# EAGLE design Protoboard MX4-7-9-ESP12 (EAGLE 7.7.0)
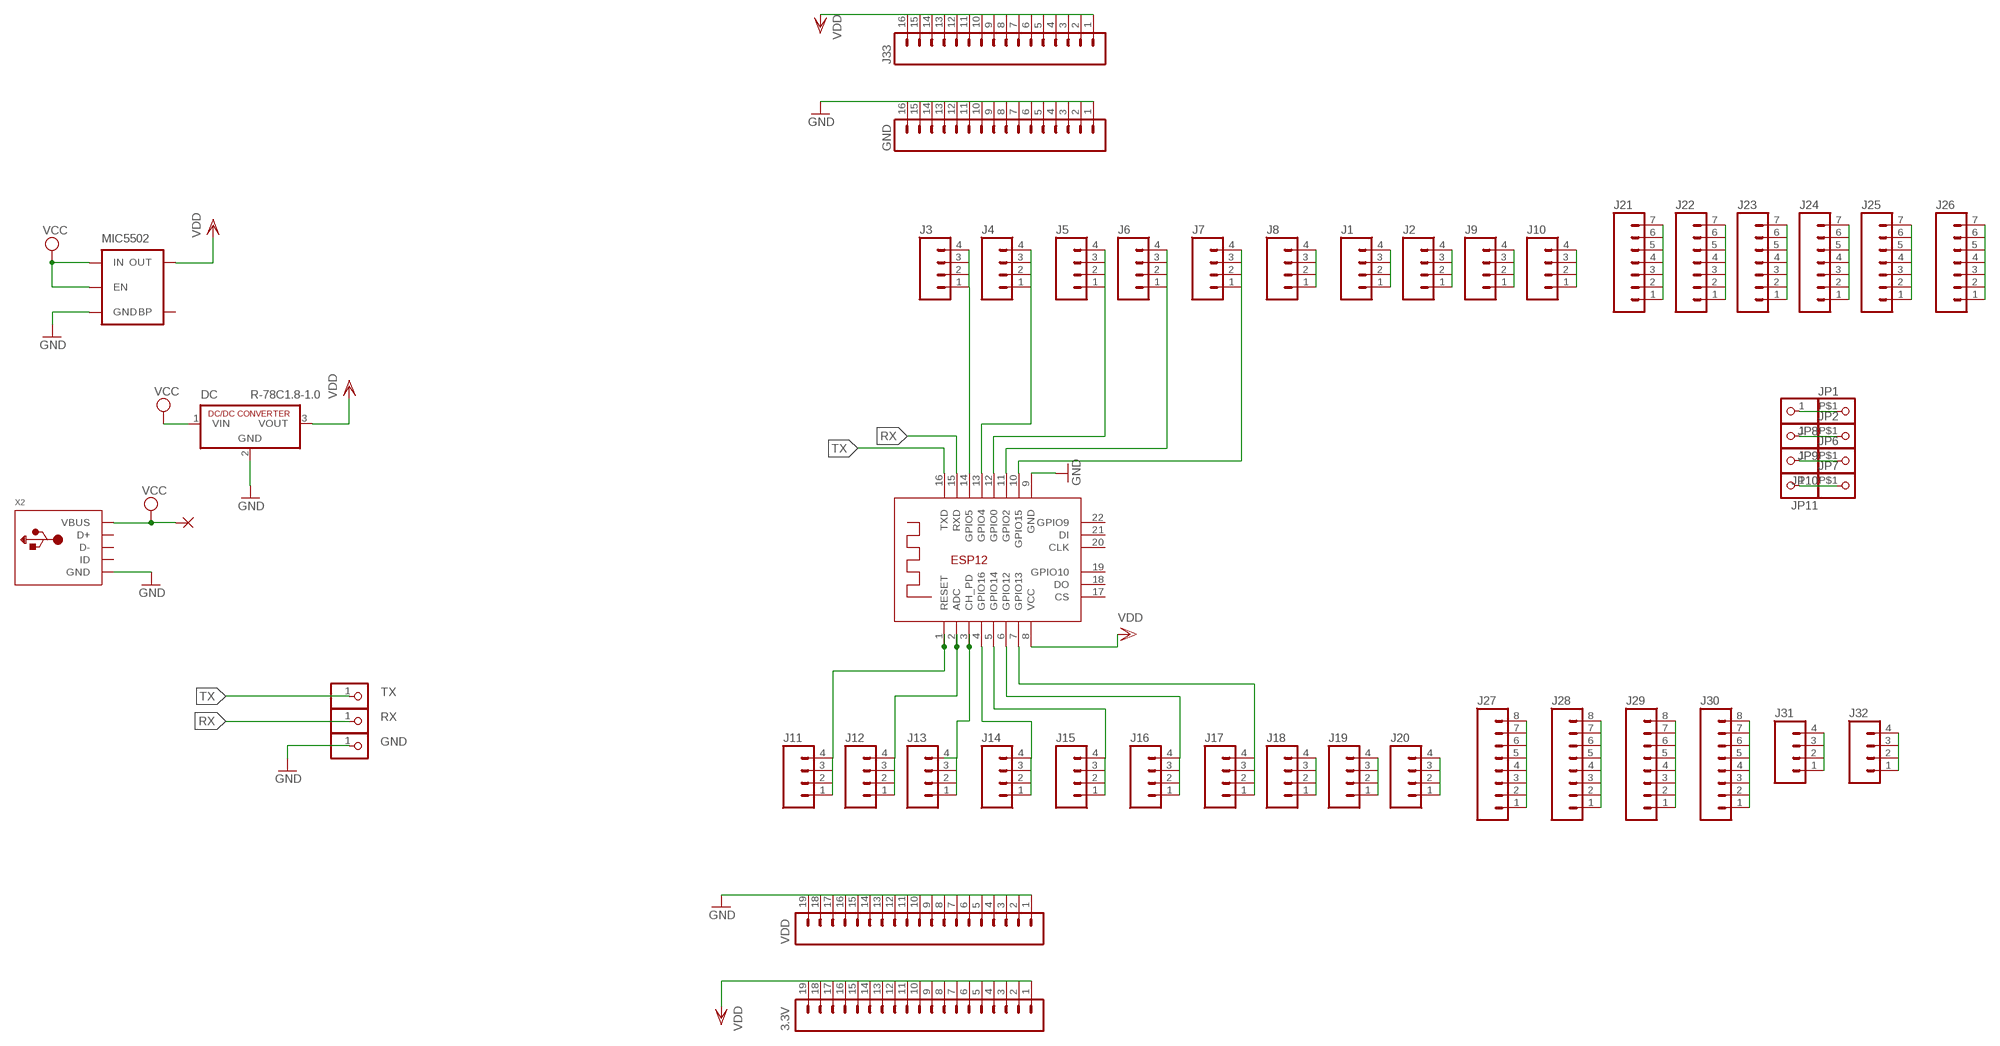
[diagram p0: schematic, sheet 1]

## Parts
3.3V  M191X19_NO_SILK  [1X19_NO_SILK]
5V  1,6/0,8  [1,6/0,8]
DC  R-78C1.8-1.0  [SIP3]
GND  M161X16_NO_SILK  [1X16_NO_SILK]
J1  M04NO_SILK_ALL_ROUND  [1X04_NO_SILK_ALL_ROUND]
J2  M04NO_SILK_ALL_ROUND  [1X04_NO_SILK_ALL_ROUND]
J3  M04NO_SILK_ALL_ROUND  [1X04_NO_SILK_ALL_ROUND]
J4  M04NO_SILK_ALL_ROUND  [1X04_NO_SILK_ALL_ROUND]
J5  M04NO_SILK_ALL_ROUND  [1X04_NO_SILK_ALL_ROUND]
J6  M04NO_SILK_ALL_ROUND  [1X04_NO_SILK_ALL_ROUND]
J7  M04NO_SILK_ALL_ROUND  [1X04_NO_SILK_ALL_ROUND]
J8  M04NO_SILK_ALL_ROUND  [1X04_NO_SILK_ALL_ROUND]
J9  M04NO_SILK_ALL_ROUND  [1X04_NO_SILK_ALL_ROUND]
J10  M04NO_SILK_ALL_ROUND  [1X04_NO_SILK_ALL_ROUND]
J11  M04NO_SILK_ALL_ROUND  [1X04_NO_SILK_ALL_ROUND]
J12  M04NO_SILK_ALL_ROUND  [1X04_NO_SILK_ALL_ROUND]
J13  M04NO_SILK_ALL_ROUND  [1X04_NO_SILK_ALL_ROUND]
J14  M04NO_SILK_ALL_ROUND  [1X04_NO_SILK_ALL_ROUND]
J15  M04NO_SILK_ALL_ROUND  [1X04_NO_SILK_ALL_ROUND]
J16  M04NO_SILK_ALL_ROUND  [1X04_NO_SILK_ALL_ROUND]
J17  M04NO_SILK_ALL_ROUND  [1X04_NO_SILK_ALL_ROUND]
J18  M04NO_SILK_ALL_ROUND  [1X04_NO_SILK_ALL_ROUND]
J19  M04NO_SILK_ALL_ROUND  [1X04_NO_SILK_ALL_ROUND]
J20  M04NO_SILK_ALL_ROUND  [1X04_NO_SILK_ALL_ROUND]
J21  M07NO_SILK  [1X07_NO_SILK]
J22  M07NO_SILK  [1X07_NO_SILK]
J23  M07NO_SILK  [1X07_NO_SILK]
J24  M07NO_SILK  [1X07_NO_SILK]
J25  M07NO_SILK  [1X07_NO_SILK]
J26  M07NO_SILK  [1X07_NO_SILK]
J27  M08NO_SILK_FEMALE_PTH  [1X08_NO_SILK]
J28  M08NO_SILK_FEMALE_PTH  [1X08_NO_SILK]
J29  M08NO_SILK_FEMALE_PTH  [1X08_NO_SILK]
J30  M08NO_SILK_FEMALE_PTH  [1X08_NO_SILK]
J31  M04NO_SILK_ALL_ROUND  [1X04_NO_SILK_ALL_ROUND]
J32  M04NO_SILK_ALL_ROUND  [1X04_NO_SILK_ALL_ROUND]
J33  M161X16_NO_SILK  [1X16_NO_SILK]
JP1  PINHD-1X1-BIGPOGO  [1X1-BIGPOGO]
JP2  PINHD-1X1-BIGPOGO  [1X1-BIGPOGO]
JP3  TX  PINHD-1X1CB  [1X01-CLEANBIG]
JP4  RX  PINHD-1X1CB  [1X01-CLEANBIG]
JP5  GND  PINHD-1X1CB  [1X01-CLEANBIG]
JP6  PINHD-1X1-BIGPOGO  [1X1-BIGPOGO]
JP7  PINHD-1X1-BIGPOGO  [1X1-BIGPOGO]
JP8  PINHD-1X1CB  [1X01-CLEANBIG]
JP9  PINHD-1X1CB  [1X01-CLEANBIG]
JP10  PINHD-1X1CB  [1X01-CLEANBIG]
JP11  PINHD-1X1CB  [1X01-CLEANBIG]
MIC5502  MIC52053.3V  [SOT23-5]
VDD  M191X19_NO_SILK  [1X19_NO_SILK]
X1  ESP-12E  [ESP-12E]
X2  USBMICRO_20329  [4UCONN_20329]

## Nets
GND: DC.2(GND) GND.1 GND.2 GND.3 GND.4 GND.5 GND.6 GND.7 GND.8 GND.9 GND.10 GND.11 GND.12 GND.13 GND.14 GND.15 GND.16 JP5.1 MIC5502.2(GND) VDD.1 VDD.2 VDD.3 VDD.4 VDD.5 VDD.6 VDD.7 VDD.8 VDD.9 VDD.10 VDD.11 VDD.12 VDD.13 VDD.14 VDD.15 VDD.16 VDD.17 VDD.18 VDD.19 X1.9(GND) X2.BASE@1(GND) X2.BASE@2(GND) X2.GND X2.SPRT@1(GND) X2.SPRT@2(GND) X2.SPRT@3(GND) X2.SPRT@4(GND)
N$1: J21.1 J21.2 J21.3 J21.4 J21.5 J21.6 J21.7
N$3: J8.1 J8.2 J8.3 J8.4
N$7: J1.1 J1.2 J1.3 J1.4
N$8: J2.1 J2.2 J2.3 J2.4
N$9: J3.1 J3.2 J3.3 J3.4 X1.14(GPIO5)
N$10: J4.1 J4.2 J4.3 J4.4 X1.13(GPIO4)
N$11: J5.1 J5.2 J5.3 J5.4 X1.12(GPIO0)
N$12: J6.1 J6.2 J6.3 J6.4 X1.11(GPIO2)
N$13: J7.1 J7.2 J7.3 J7.4 X1.10(GPIO15)
N$14: J9.1 J9.2 J9.3 J9.4
N$15: J10.1 J10.2 J10.3 J10.4
N$16: J18.1 J18.2 J18.3 J18.4
N$17: J22.1 J22.2 J22.3 J22.4 J22.5 J22.6 J22.7
N$18: J23.1 J23.2 J23.3 J23.4 J23.5 J23.6 J23.7
N$19: J24.1 J24.2 J24.3 J24.4 J24.5 J24.6 J24.7
N$20: J25.1 J25.2 J25.3 J25.4 J25.5 J25.6 J25.7
N$21: J26.1 J26.2 J26.3 J26.4 J26.5 J26.6 J26.7
N$22: J27.1 J27.2 J27.3 J27.4 J27.5 J27.6 J27.7 J27.8
N$23: J19.1 J19.2 J19.3 J19.4
N$24: J20.1 J20.2 J20.3 J20.4
N$25: J28.1 J28.2 J28.3 J28.4 J28.5 J28.6 J28.7 J28.8
N$26: J14.1 J14.2 J14.3 J14.4 X1.4(GPIO16)
N$27: J29.1 J29.2 J29.3 J29.4 J29.5 J29.6 J29.7 J29.8
N$28: J30.1 J30.2 J30.3 J30.4 J30.5 J30.6 J30.7 J30.8
N$29: J31.1 J31.2 J31.3 J31.4
N$30: J32.1 J32.2 J32.3 J32.4
N$31: JP1.P$1 JP8.1
N$32: JP2.P$1 JP9.1
N$33: JP6.P$1 JP10.1
N$34: J17.1 J17.2 J17.3 J17.4 X1.7(GPIO13)
N$35: JP7.P$1 JP11.1
N$50: J11.1 J11.2 J11.3 J11.4 X1.1(RESET)
N$51: J12.1 J12.2 J12.3 J12.4 X1.2(ADC)
N$52: J13.1 J13.2 J13.3 J13.4 X1.3(CH_PD)
N$55: J15.1 J15.2 J15.3 J15.4 X1.5(GPIO14)
N$56: J16.1 J16.2 J16.3 J16.4 X1.6(GPIO12)
RX: JP4.1 X1.15(RXD)
TX: JP3.1 X1.16(TXD)
VCC: 5V.1(P) DC.1(VIN) MIC5502.1(IN) MIC5502.3(EN) X2.VBUS
VDD: 3.3V.1 3.3V.2 3.3V.3 3.3V.4 3.3V.5 3.3V.6 3.3V.7 3.3V.8 3.3V.9 3.3V.10 3.3V.11 3.3V.12 3.3V.13 3.3V.14 3.3V.15 3.3V.16 3.3V.17 3.3V.18 3.3V.19 DC.3(VOUT) J33.1 J33.2 J33.3 J33.4 J33.5 J33.6 J33.7 J33.8 J33.9 J33.10 J33.11 J33.12 J33.13 J33.14 J33.15 J33.16 MIC5502.5(OUT) X1.8(VCC)
Unconnected: MIC5502.4(BP) X1.17(CS) X1.18(DO) X1.19(GPIO10) X1.20(CLK) X1.21(DI) X1.22(GPIO9) X2.D+ X2.D- X2.ID

## Library data of the parts
3.3V VDD = SparkFun-Connectors:M19: 1x19 .1" header
5V = wirepad:1,6/0,8: THROUGH-HOLE PAD
DC = dc-dc-converter:R-78C*-1.0: INNOLINE DC/DC-Converter 1.0 AMP SIP3 Single Output Source: Data sheet <http://www.mikrocontroller.net/attachment/150645/157764-da-01-en-DC_DC_WANDLER_R_78C5_0_1_0.pdf>
GND J33 = SparkFun-Connectors:M16: 1x16 .1" header
J1-J20 J31 J32 = SparkFun-Connectors:M04: Header 4 Standard 4-pin 0.1" header. Use with straight break away headers (SKU : PRT-00116), right angle break away headers (PRT-00553), swiss pins (PRT-00743), machine pins (PRT-00117), and female headers (PRT-00115). Molex polarized connector foot print use with SKU : PRT-08231 with associated crimp pins and housings. 1MM SMD Version SKU: PRT-10208; PROD_ID: CONN-09696
J21-J26 = SparkFun-Connectors:M07: Header 7 Standard 7-pin 0.1" header. Use with straight break away headers (SKU : PRT-00116), right angle break away headers (PRT-00553), swiss pins (PRT-00743), machine pins (PRT-00117), and female headers (PRT-00115). NOTES ON THE VARIANTS LOCK and LOCK_LONGPADS... This footprint was designed to help hold the alignment of a through-hole component (i.e. 7-pin header) while soldering it into place. You may notice that each hole has been shifted either up or down by 0.005 of an inch from it's more standard position (which is usually a perfectly straight line). This slight alteration caused the pins (the squares in the middle) to touch the edges of the holes. Because they are alternating, it causes a "brace" to hold the header in place. 0.005 has proven to be the perfect amount of "off-center" position when using our standard breakaway headers. Although looks a little odd when you look at the bare footprint, once you have a header in there, the alteration is very hard to notice. Also, if you push a header all the way into place, it is covered up entirely on the bottom side. This idea of altering the position of holes to aid alignment will be further integrated into the Sparkfun Library for other footprints. It can help hold any component with 3 or more connection pins.
J27-J30 = SparkFun-Connectors:M08: Header 8 Standard 8-pin 0.1" header. Use with straight break away headers (SKU : PRT-00116), right angle break away headers (PRT-00553), swiss pins (PRT-00743), machine pins (PRT-00117), and female headers (PRT-00115).; PROD_ID: CONN-08438
JP1-JP11 = adafruit:PINHD-1X1: Pin header 1x1 for 0.1" spacing With round pins
MIC5502 = SparkFun-PowerIC:MIC5205: MIC5205 150mA vreg 3.3V - VREG-00822 5V - VREG-00823; PROD_ID: VREG-00822
X1 = microbuilder:ESP-12E
X2 = microbuilder:USB: USB Connectors USBMINIB - Surface Mount Female Mini-B USB Connector 4UConnector: 06564

## Net classes
0 default: width 0.508 mm, drill 0.508 mm, clearance 0.127 mm

## Board
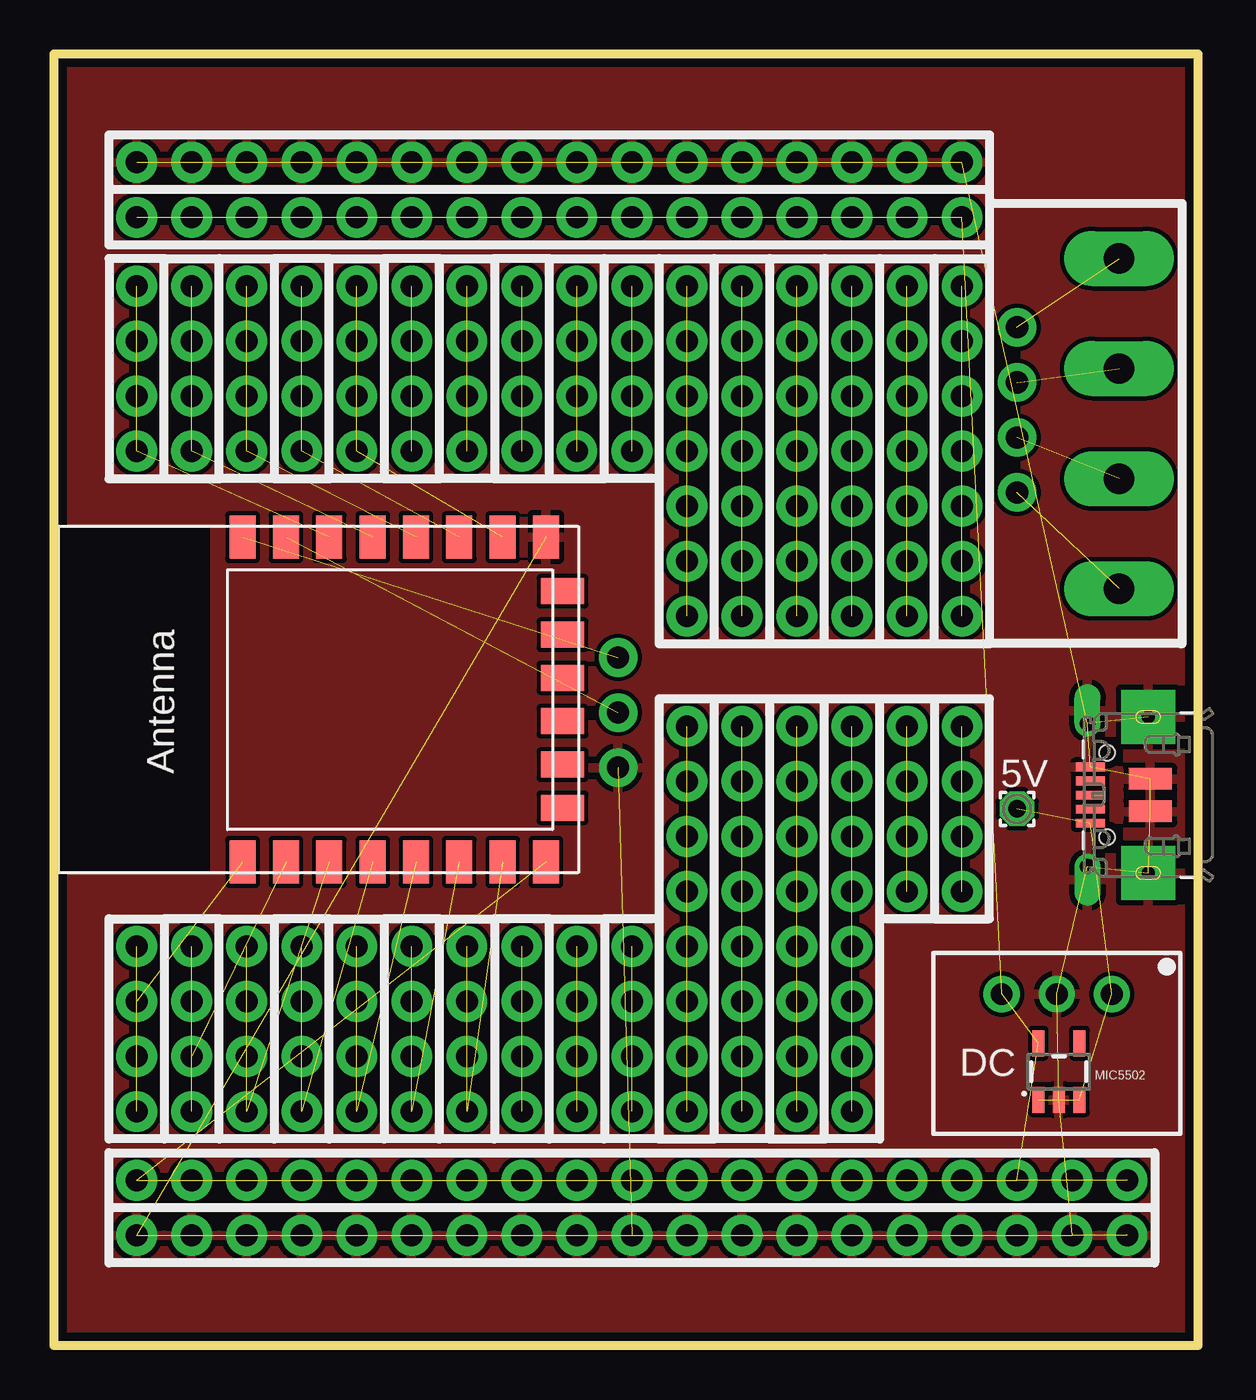
[diagram p1: board, top side]
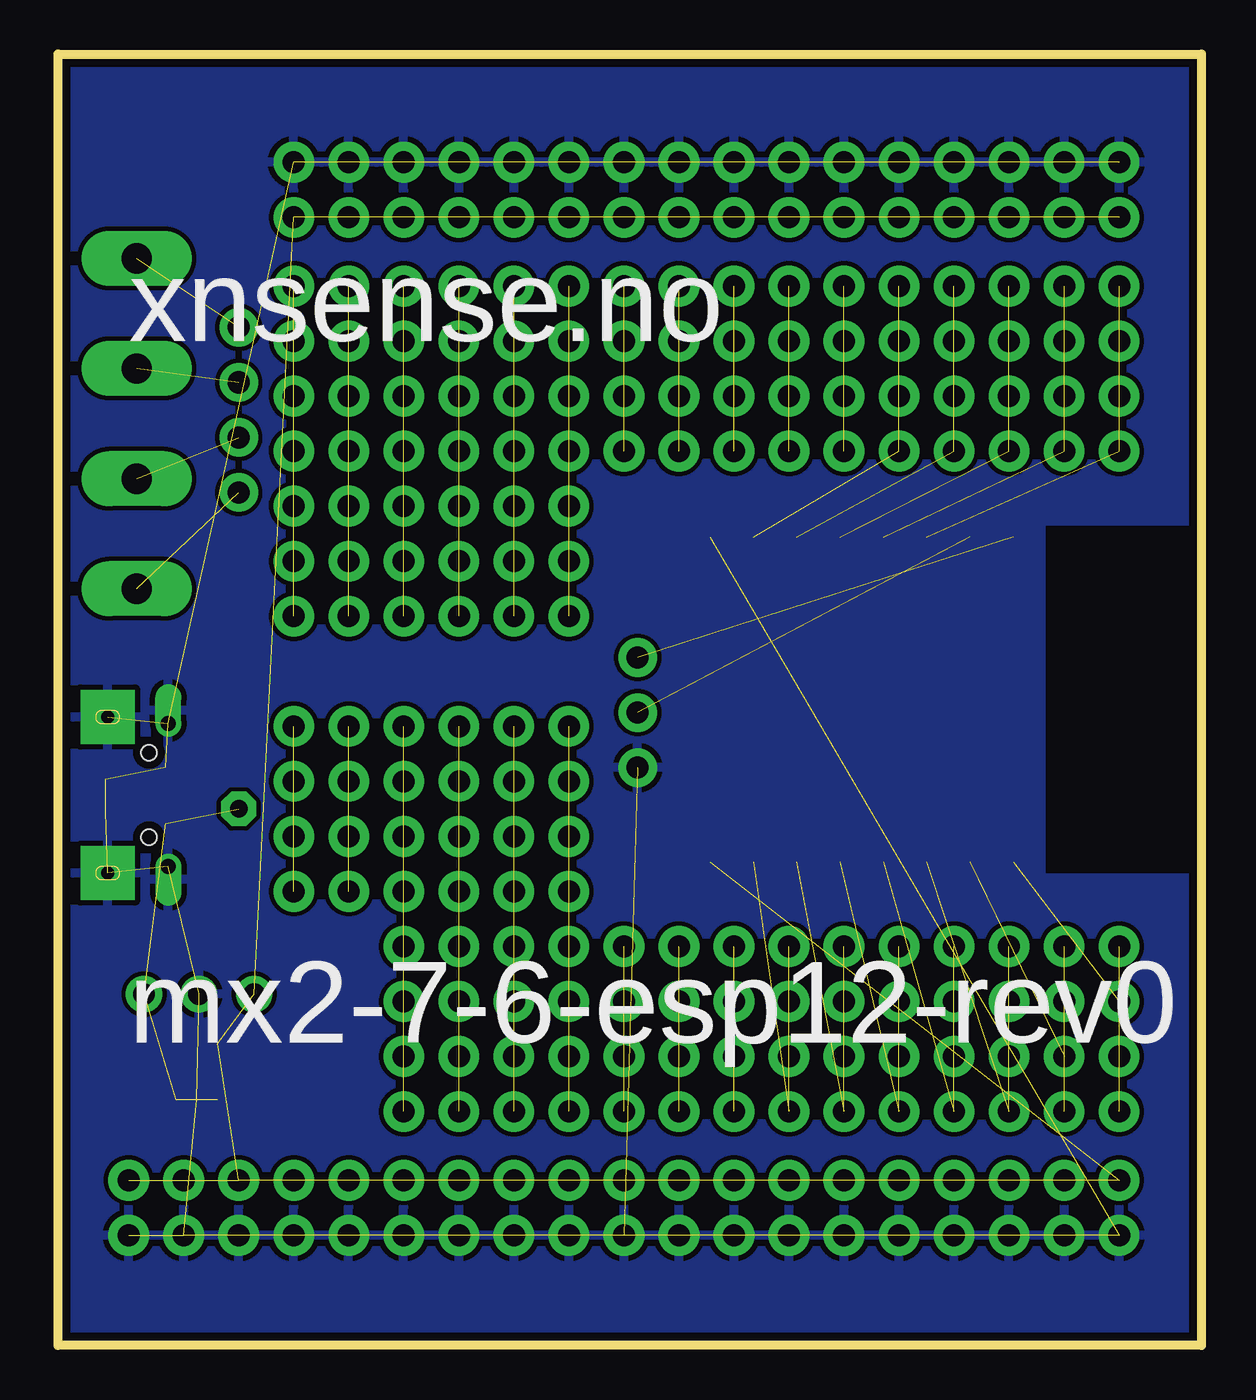
[diagram p2: board, bottom side, seen from below]

Size 52.8 x 59.6 mm. Coordinates in mm from the lower left corner, seen from the top.
Outline: 0,0 0,59.6 52.8,59.6 52.8,0 0,0
Copper layers (1*16): Top 0.035mm / dielectric 1.5mm / Bottom 0.035mm
Design rules "default *": minimum track width 10mil, minimum drill 20mil, track to track 8mil, track to pad 8mil, pad to pad 8mil, via to via 8mil, smd to smd 8mil, copper to edge 15mil, drill to drill 8mil, minimum pad ring 10mil, minimum via ring 8mil, stop-mask expansion 4mil, vias tented up to drill 0mil, thermal gap 10mil

### Footprints (pad centres in the part's own frame; a part is rotated, then mirrored left to right if it is on the bottom)
1X19_NO_SILK = drill 1.016 pad 1.88: 1 0,0; 2 2.54,0; 3 5.08,0; 4 7.62,0; 5 10.16,0; 6 12.7,0; 7 15.24,0; 8 17.78,0; 9 20.32,0; 10 22.86,0; 11 25.4,0; 12 27.94,0; 13 30.48,0; 14 33.02,0; 15 35.56,0; 16 38.1,0; 17 40.64,0; 18 43.18,0; 19 45.72,0
1,6/0,8 = drill 0.813 pad 1.6 octagon: 1 0,0
SIP3 = drill 1 pad 1.676: 1 -2.54,0; 2 0,0; 3 2.54,0
1X16_NO_SILK = drill 1.016 pad 1.88: 1 0,0; 2 2.54,0; 3 5.08,0; 4 7.62,0; 5 10.16,0; 6 12.7,0; 7 15.24,0; 8 17.78,0; 9 20.32,0; 10 22.86,0; 11 25.4,0; 12 27.94,0; 13 30.48,0; 14 33.02,0; 15 35.56,0; 16 38.1,0
1X04_NO_SILK_ALL_ROUND = drill 1.016 pad 1.88: 1 0,0; 2 2.54,0; 3 5.08,0; 4 7.62,0
1X07_NO_SILK = drill 1.016 pad 1.88: 1 0,0; 2 2.54,0; 3 5.08,0; 4 7.62,0; 5 10.16,0; 6 12.7,0; 7 15.24,0
1X08_NO_SILK = drill 1.016 pad 1.88: 1 0,0; 2 2.54,0; 3 5.08,0; 4 7.62,0; 5 10.16,0; 6 12.7,0; 7 15.24,0; 8 17.78,0
1X1-BIGPOGO = drill 1.4 pad 2.54 long: P$1 0,0
1X01-CLEANBIG = drill 1.016 pad 1.778: 1 0,0
SOT23-5 = smd 0.55 x 1.2: 1 -0.95,-1.3; 2 0,-1.3; 3 0.95,-1.3; 4 0.95,1.3; 5 -0.95,1.3
ESP-12E = smd 2 x 1.2: 1 -7.5,5.77; 2 -7.5,3.77; 3 -7.5,1.77; 4 -7.5,-0.23; 5 -7.5,-2.23; 6 -7.5,-4.23; 7 -7.5,-6.23; 8 -7.5,-8.23; 9 7.5,-8.23; 10 7.5,-6.23; 11 7.5,-4.23; 12 7.5,-2.23; 13 7.5,-0.23; 14 7.5,1.77; 15 7.5,3.77; 16 7.5,5.77 | smd 1.2 x 2: 17 -5,-9; 18 -3,-9; 19 -1,-9; 20 1,-9; 21 3,-9; 22 5,-9
4UCONN_20329 = smd 1 x 2: BASE@1 -0.75,-2; BASE@2 0.75,-2 | smd 0.4 x 1.35: D+ 0,0.775; D- -0.65,0.775; GND 1.3,0.775; ID 0.65,0.775; VBUS -1.3,0.775 | drill 0.7 offset: SPRT@1 -3.3,0.9; SPRT@2 3.3,0.9 | drill 0.6 pad 2.5 square: SPRT@3 -3.6,-1.9; SPRT@4 3.6,-1.9 | hole 0.7: -1.95,0; 1.95,0

### Placement (x,y rotation side)
3.3V  3.81,7.62 0 top
5V  44.45,24.77 0 top
DC  46.28,16.21 180 top
GND  3.81,54.61 0 top
J1  19.05,41.27 90 top
J2  21.59,41.27 90 top
J3  3.81,41.27 90 top
J4  6.35,41.27 90 top
J5  8.89,41.27 90 top
J6  11.43,41.27 90 top
J7  13.97,41.27 90 top
J8  16.51,41.27 90 top
J9  24.13,41.27 90 top
J10  26.67,41.27 90 top
J11  3.81,10.79 90 top
J12  6.35,10.79 90 top
J13  8.89,10.79 90 top
J14  11.43,10.79 90 top
J15  13.97,10.79 90 top
J16  16.51,10.79 90 top
J17  19.05,10.79 90 top
J18  21.59,10.79 90 top
J19  24.13,10.79 90 top
J20  26.67,10.79 90 top
J21  29.21,33.66 90 top
J22  31.75,33.66 90 top
J23  34.29,33.66 90 top
J24  36.83,33.66 90 top
J25  39.37,33.66 90 top
J26  41.91,33.66 90 top
J27  29.21,10.79 90 top
J28  31.75,10.79 90 top
J29  34.29,10.79 90 top
J30  36.83,10.79 90 top
J31  39.37,20.95 90 top
J32  41.91,20.95 90 top
J33  3.81,52.07 0 top
JP1  49.16,50.16 0 top
JP2  49.16,45.09 0 top
JP3  26.04,31.75 0 top
JP4  26.04,29.21 0 top
JP5  26.04,26.67 0 top
JP6  49.16,40.01 0 top
JP7  49.16,34.92 0 top
JP8  44.45,46.99 0 top
JP9  44.45,44.45 0 top
JP10  44.45,41.91 0 top
JP11  44.45,39.37 0 top
MIC5502  46.38,12.64 0 top
VDD  3.81,5.08 0 top
X1  14.47,29.81 90 top
X2  48.6,25.4 90 top

### Tracks (layer width: path | path; a pad name or v marks a point on that pad's centre or on a via)
GND  (45 unrouted)
  pour Top: 0,59.6 0,0 52.8,0 52.8,59.6
  pour Bottom: 0,59.6 0,0 52.8,0 52.8,59.6
N$1  (6 unrouted)
N$3  (3 unrouted)
N$7  (3 unrouted)
N$8  (3 unrouted)
N$9  (4 unrouted)
N$10  (4 unrouted)
N$11  (4 unrouted)
N$12  (4 unrouted)
N$13  (4 unrouted)
N$14  (3 unrouted)
N$15  (3 unrouted)
N$16  (3 unrouted)
N$17  (6 unrouted)
N$18  (6 unrouted)
N$19  (6 unrouted)
N$20  (6 unrouted)
N$21  (6 unrouted)
N$22  (7 unrouted)
N$23  (3 unrouted)
N$24  (3 unrouted)
N$25  (7 unrouted)
N$26  (4 unrouted)
N$27  (7 unrouted)
N$28  (7 unrouted)
N$29  (3 unrouted)
N$30  (3 unrouted)
N$31  (1 unrouted)
N$32  (1 unrouted)
N$33  (1 unrouted)
N$34  (4 unrouted)
N$35  (1 unrouted)
N$50  (4 unrouted)
N$51  (4 unrouted)
N$52  (4 unrouted)
N$55  (4 unrouted)
N$56  (4 unrouted)
RX  (1 unrouted)
TX  (1 unrouted)
VCC  (4 unrouted)
VDD  (37 unrouted)

### Text on the board
bNames: xnsense.no | mx2-7-6-esp12-rev0